# Altium schematic sheet Peripherals 2.SchDoc
size A4
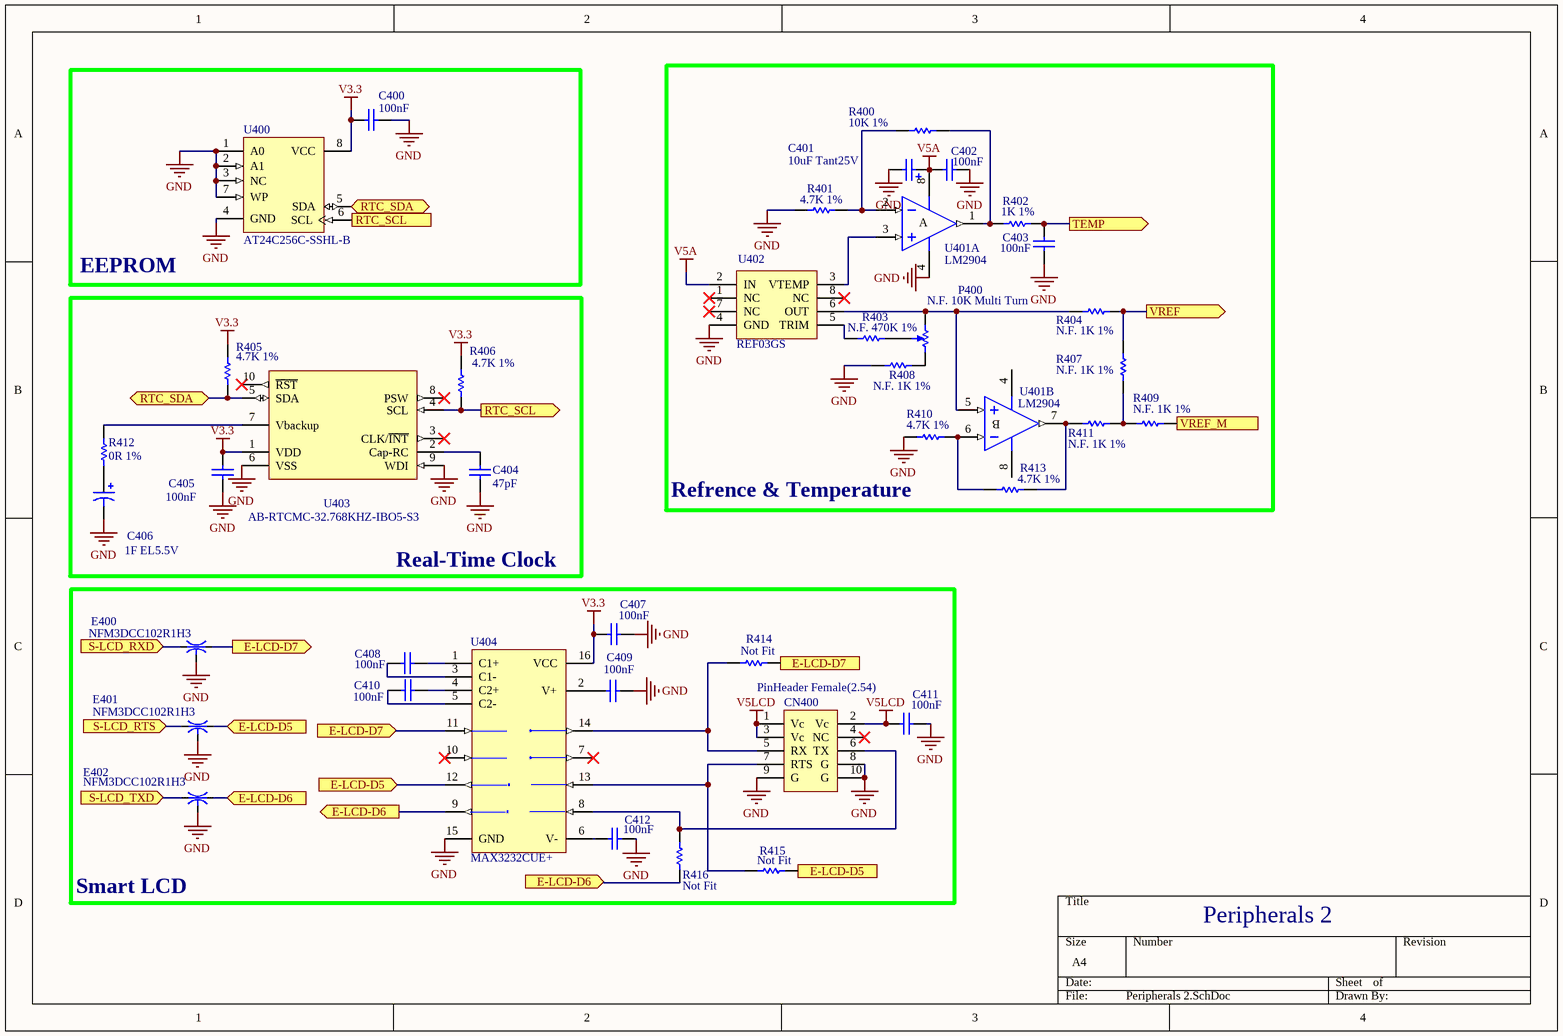
[diagram p0: Peripherals 2.SchDoc]

## Parts
C400  100nF  [0805_FA]
C401  10uF Tant25V  [B]
C402  100nF  [0805_FA]
C403  100nF  [0805_FA]
C404  47pF  [1206_FA]
C405  100nF  [0805_FA]
C406  1F EL5.5V  [CAP1F]
C407  100nF  [0805_FA]
C408  100nF  [1206_FA]
C409  100nF  [1206_FA]
C410  100nF  [1206_FA]
C411  100nF  [1206_FA]
C412  100nF  [1206_FA]
CN400  PinHeader Female(2.54)  [HDR2*5]
E400  NFM3DCC102R1H3  [EMI-1206]
E401  NFM3DCC102R1H3  [EMI-1206]
E402  NFM3DCC102R1H3  [EMI-1206]
P400  N.F. 10K Multi Turn  [3224W]
R400  10K 1%  [1206_FA]
R401  4.7K 1%  [1206_FA]
R402  1K 1%  [1206_FA]
R403  N.F. 470K 1%  [1206_FA]
R404  N.F. 1K 1%  [1206_FA]
R405  4.7K 1%  [1206_FA]
R406  4.7K 1%  [1206_FA]
R407  N.F. 1K 1%  [1206_FA]
R408  N.F. 1K 1%  [1206_FA]
R409  N.F. 1K 1%  [1206_FA]
R410  4.7K 1%  [1206_FA]
R411  N.F. 1K 1%  [1206_FA]
R412  0R 1%  [1206_FA]
R413  4.7K 1%  [1206_FA]
R414  Not Fit  [1206_FA]
R415  Not Fit  [1206_FA]
R416  Not Fit  [1206_FA]
U400  AT24C256C-SSHL-B  [SO8_N]
U401  LM2904  [SO8_N]  (parts A,B of 2)
U402  REF03GS  [SO8_N]
U403  AB-RTCMC-32.768KHZ-IBO5-S3  [VDFN-10]
U404  MAX3232CUE+  [SO16_N]

## Blocks framed on the sheet
EEPROM: C400 U400
Refrence & Temperature: C401-C403 P400 R400-R404 R407-R411 R413 U401 U402
Real-Time Clock: C404-C406 R405 R406 R412 U403
Smart LCD: C407-C412 CN400 E400-E402 R414-R416 U404

## Ports
E-LCD-D5 (in), E-LCD-D6 (in), E-LCD-D6 (out), E-LCD-D7 (in), E-LCD-D7 (out), RTC_SCL (out), RTC_SDA (bidir), S-LCD_RTS (in), S-LCD_RXD (in), S-LCD_TXD (in), TEMP (out), VREF (out), VREF_M (out)

## Nets
GND: C400.2 C401.2 C402.1 C403.1 C404.2 C405.2 C406.2 C407.2 C409.2 C411.2 C412.1 CN400.8(G) CN400.9(G) CN400.10(G) E400.2 E401.2 E402.2 R401.2 R408.2 R410.2 U400.1(A0) U400.2(A1) U400.3(NC) U400.4(GND) U400.7(WP) U401.4(V-) U402.4(GND) U403.6(VSS) U403.9(WDI) U404.15(GND)
V3.3: C400.1 C405.1 C407.1 R405.2 R406.2 U400.8(VCC) U403.1(VDD) U404.16(VCC)
V5A: C401.1 C402.2 U401.8(V+) U402.2(IN)
V5LCD: C411.1 CN400.1(Vc) CN400.2(Vc) CN400.3(Vc)
E-LCD-D5: E401.3 R415.1 U404.12(R1OUT) ; port E-LCD-D5
E-LCD-D6: E402.3 R416.2 U404.9(R2OUT) ; port E-LCD-D6
E-LCD-D7: E400.3 R414.1 U404.11(T1IN) ; port E-LCD-D7
RTC_SCL: R406.1 U400.6(SCL) U403.4(SCL) ; port RTC_SCL
RTC_SDA: R405.1 U400.5(SDA) U403.5(SDA) ; port RTC_SDA
S-LCD_RTS: E401.1 ; port S-LCD_RTS
S-LCD_RXD: E400.1 ; port S-LCD_RXD
S-LCD_TXD: E402.1 ; port S-LCD_TXD
TEMP: C403.2 R402.1 ; port TEMP
VREF: R404.2 R407.2 ; port VREF
VREF_M: R409.1 ; port VREF_M
NetC404_1: C404.1 U403.2(Cap-RC)
NetC406_1: C406.1 R412.2
NetC408_1: C408.1 U404.3(C1-)
NetC408_2: C408.2 U404.1(C1+)
NetC409_1: C409.1 U404.2(V+)
NetC410_1: C410.1 U404.5(C2-)
NetC410_2: C410.2 U404.4(C2+)
NetC412_2: C412.2 U404.6(V-)
NetCN400_5: CN400.5(RX) R414.2 U404.14(T1OUT)
NetCN400_6: CN400.6(TX) R416.1 U404.8(R2IN)
NetCN400_7: CN400.7(RTS) R415.2 U404.13(R1IN)
NetP400_CCW: P400.CCW(-) R404.1 U401.5(IN+) U402.6(OUT)
NetP400_CW: P400.CW(+) R408.1
NetP400_W: P400.W R403.1
NetR400_1: R400.1 R402.2 U401.1(OUT)
NetR400_2: R400.2 R401.1 U401.2(IN-)
NetR403_2: R403.2 U402.5(TRIM)
NetR407_1: R407.1 R409.2 R411.1
NetR410_1: R410.1 R413.2 U401.6(IN-)
NetR411_2: R411.2 R413.1 U401.7(OUT)
NetR412_1: R412.1 U403.7(Vbackup)
NetU401_3: U401.3(IN+) U402.3(VTEMP)

Not connected (* = marked no-connect by the designer): CN400 4(NC)*; U402 1(NC)* 7(NC)* 8(NC)*; U403 3(CLK/~{INT})* 8(PSW)* 10(~{RST})*; U404 7(T2OUT)* 10(T2IN)*

## Notes on the sheet
- Peripherals 2
- (in symbol AD642JH, part A) A
- (in symbol AD642JH, part B) B

## Library data of the parts
C400 C402-C405 = Cap Semi: Capacitor (Semiconductor SIM Model); Value: 100pF; Published: 8-Jun-2000; LatestRevisionDate: 17-Jul-2002; LatestRevisionNote: Re-released for DXP Platform.; PackageReference: C1206; Publisher: Altium Limited
C401 = Cap Pol3: Polarized Capacitor (Surface Mount); Value: 100pF; Published: 8-Jun-2000; LatestRevisionDate: 17-Jul-2002; LatestRevisionNote: Re-released for DXP Platform.; PackageReference: C0805; Publisher: Altium Limited
C406 = Cap Pol2: Polarized Capacitor (Axial); Value: 100pF; Published: 8-Jun-2000; LatestRevisionDate: 17-Jul-2002; LatestRevisionNote: Re-released for DXP Platform.; PackageReference: POLAR0.8; Publisher: Altium Limited
C407-C412 = Cap: Capacitor; Published: 8-Jun-2000; LatestRevisionDate: 17-Jul-2002; LatestRevisionNote: Re-released for DXP Platform.; PackageReference: RAD-0.3; Publisher: Altium Limited
CN400 = Header 5X2: Header, 5-Pin, Dual row; LatestRevisionDate: 17-Jul-2002; LatestRevisionNote: Re-released for DXP Platform.; Publisher: Altium Limited
E400-E402 = Component_1
P400 = RPot SM: Square Trimming Potentiometer; Published: 17-Dec-2003; DatasheetDocument: Oct-2003; PackageReference: POT4MM-2; Publisher: Altium Limited; ComponentLink1Description: Manufacturer Link; ComponentLink1URL: http://bourns.com/2/search.html
R400 R401 R403 R405 R406 R410 R412-R416 = Res Semi: Semiconductor Resistor; Value: 1K; Published: 8-Jun-2000; LatestRevisionDate: 17-Jul-2002; LatestRevisionNote: Re-released for DXP Platform.; PackageReference: AXIAL-0.5; Publisher: Altium Limited
R402 R404 R407-R409 R411 = Res Semi: Semiconductor Resistor; Published: 8-Jun-2000; LatestRevisionDate: 17-Jul-2002; LatestRevisionNote: Re-released for DXP Platform.; PackageReference: AXIAL-0.5; Publisher: Altium Limited; Value: 1K
U400 = AT24HC04BN-SP25-T: 4Kbit (512 x 8), 2-wire Bus Serial Automotive EEPROM with 1/2 memory Write Protect, 2.5V, 8-Pin SOIC, Tape & Reel; Published: 20-Sep-2010; DatasheetVersion: 5192C,  Jan-2009; PackageVersion: revC, Mar-2005; PackageReference: 8S1; Publisher: Altium Limited; PackageDescription: 8-Lead (0.150" Wide Body), Plastic Gull Wing Small Outline (JEDEC SOIC); Code_JEDEC: MS-012-AA; Code_IPC: SOIC127P600-8; ComponentLink1Description: Manufacturer Link; ComponentLink1URL: http://www.atmel.com/products/serial/default.asp; ComponentLink2Description: Datasheet; ComponentLink2URL: http://www.atmel.com/dyn/resources/prod_documents/doc5192.pdf; ComponentLink3Description: Atmel.com Home; ComponentLink3URL: http://www.atmel.com
U401 = AD642JH: Precision, Low Cost Dual BiFET Operational Amplifier; Note: Pin 4 connected to case.; ComponentAvailability: Obsolete; Published: 8-Jun-2000; LatestRevisionDate: 17-Jul-2002; LatestRevisionNote: Re-released for DXP Platform.; DatasheetVersion: REV. 0; PackageVersion: 1990; PackageReference: H-08B; Publisher: Altium Limited; PackageDescription: Can; 8 Leads; Pin Circle Dia. 5.84 mm; Lead Dia. 0.53 mm (max); Code_JEDEC: MO-006-AH; ComponentLink1Description: Manufacturer Link; ComponentLink1URL: http://www.analog.com/; ComponentLink2Description: Datasheet; ComponentLink2URL: http://www.analog.com/UploadedFiles/Obsolete_Data_Sheets/765962AD642.pdf
U402 = REF03GS: +2.5V Precision Voltage Reference; Note: Pins 1, 7 and 8 are not connected; Published: 8-Jun-2000; LatestRevisionDate: 13-Apr-2006; LatestRevisionNote: IPC-7351 Footprint Added.; DatasheetVersion: REV. C 1992; PackageVersion: revA; PackageReference: SO-8; Publisher: Altium Limited; PackageDescription: 8-Pin Small Outline Integrated Circuit 1.27 mm Pitch; Code_JEDEC: MS-012-AA; Code_IPC: SOIC127P600-8; ComponentLink1Description: Manufacturer Link; ComponentLink1URL: http://www.analog.com/en/prod/0%2C2877%2CREF03%2C00.html; ComponentLink2Description: Datasheet; ComponentLink2URL: http://www.analog.com/UploadedFiles/Data_Sheets/56211209654177REF03_f.pdf
U403 = AT90LS2323-4SC: 8-Bit AVR Microcontroller with 2K Bytes of In-System Programmable Flash Memory; Published: 17-Sep-2003; LatestRevisionDate: 13-Apr-2006; LatestRevisionNote: IPC-7351 Footprint Added.; DatasheetVersion: 1004D-09/01; PackageVersion: revB, May-2002; PackageReference: 8S2; Publisher: Altium Limited; PackageDescription: 8-Pin Small Outline Package 1.27 mm Pitch; ComponentLink1Description: Manufacturer Link; ComponentLink1URL: http://www.atmel.com; ComponentLink2Description: Datasheet; ComponentLink2URL: http://www.atmel.com/dyn/resources/prod_documents/doc1004.pdf
U404 = MAX3232CUE: 3.0V TO 5.5V, Low-Power, up to 1Mbps, True RS-232 Transceiver Using Four 0.1µF External Capacitor; Published: 16-Jan-2001; LatestRevisionDate: 29-May-2009; LatestRevisionNote: IPC-7351 Footprint Added.; DatasheetVersion: Mar-1999; PackageVersion: 21-0066 C; PackageReference: TSSOP16; Publisher: Altium Limited; PackageDescription: 16-Pin Thin Small Outline Package 0.65 mm Pitch; ComponentLink1Description: Manufacturer Link; ComponentLink1URL: http://www.maxim-ic.com/; ComponentLink2Description: Datasheet; ComponentLink2URL: http://pdfserv.maxim-ic.com/en/ds/MAX3222-MAX3241.pdf